# EAGLE design irsm-v1 (EAGLE 7.6.0)
CNAME: IRS sensor (RFM69HW); CREVISION: 1; DESIGNER: Dariusz Mazur
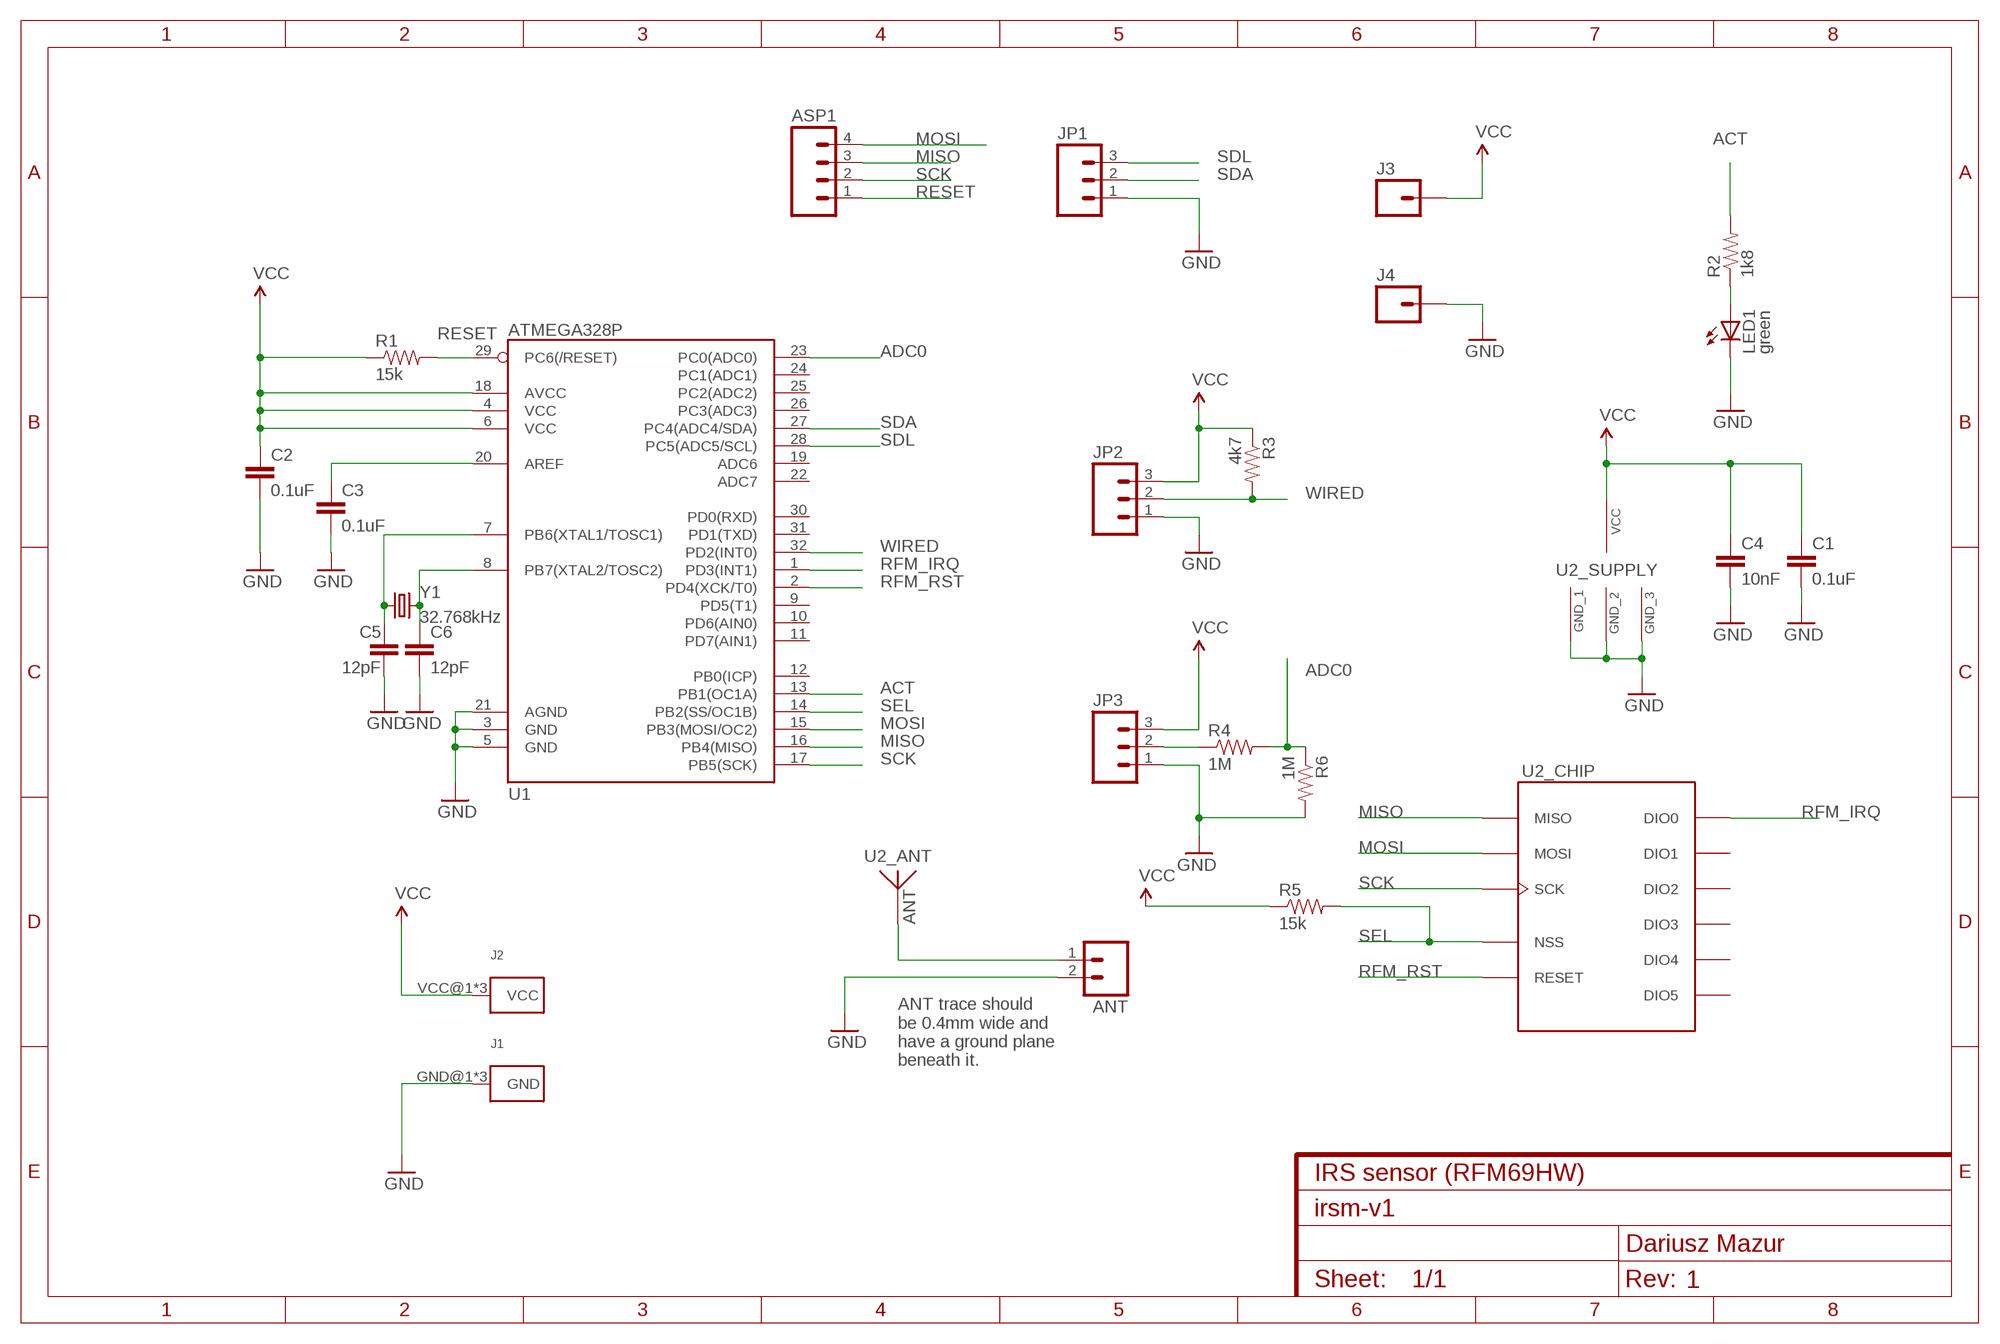
[diagram p0: schematic, sheet 1]

## Parts
ANT  M02PTH3  [1X02_LONGPADS]
ASP1  M04PTH  [1X04]
C1  0.1uF  0.1UF-25V(+80/-20%)(0603)  [0603-CAP]
C2  0.1uF  0.1UF-25V(+80/-20%)(0603)  [0603-CAP]
C3  0.1uF  0.1UF-25V(+80/-20%)(0603)  [0603-CAP]
C4  10nF  CAP0603-CAP  [0603-CAP]
C5  12pF  12PF-50V-5%(0603)  [0603-CAP]
C6  12pF  12PF-50V-5%(0603)  [0603-CAP]
J1  KEYSTONE-629  [KEYSTONE_AA_AAA_BATTERY_TERMINAL-629]
J2  KEYSTONE-637  [KEYSTONE_AA_AAA_BATTERY_TERMINAL-637]
J3  M01PTH  [1X01]
J4  M01PTH  [1X01]
JP1  M03PTH  [1X03]
JP2  M03PTH  [1X03]
JP3  M03PTH  [1X03]
LED1  green  LED0603  [LED-0603]
R1  15k  RESISTOR0603-RES  [0603-RES]
R2  1k8  RESISTOR0603-RES  [0603-RES]
R3  4k7  RESISTOR0603-RES  [0603-RES]
R4  1M  RESISTOR0603-RES  [0603-RES]
R5  15k  RESISTOR0603-RES  [0603-RES]
R6  1M  RESISTOR0603-RES  [0603-RES]
U1  ATMEGA328P  ATMEGA328_SMT  [TQFP32-08]
U2  RFM69HCW-S2  [HOPE-RF-16]
Y1  32.768kHz  CRYSTAL3.2X1.5MM  [CRYSTAL-SMD-3.2X1.5MM]

## Nets
ACT: R2.2 U1.13(PB1(OC1A))
ADC0: R4.2 R6.1 U1.23(PC0(ADC0))
GND: ANT.2 C1.2 C2.2 C3.2 C4.2 C5.2 C6.2 J1.GND@1(GND) J1.GND@2(GND) J1.GND@3(GND) J4.1 JP1.1 JP2.1 JP3.1 LED1.C R6.2 U1.3(GND) U1.5(GND) U1.21(AGND) U2.GND1(_SUPPLY:GND_1) U2.GND2(_SUPPLY:GND_2) U2.GND3(_SUPPLY:GND_3)
MISO: ASP1.3 U1.16(PB4(MISO)) U2.MISO(_CHIP:MISO)
MOSI: ASP1.4 U1.15(PB3(MOSI/OC2)) U2.MOSI(_CHIP:MOSI)
N$1: LED1.A R2.1
N$2: JP3.2 R4.1
N$3: ANT.1 U2.ANT(_ANT:ANT)
N$4: C3.1 U1.20(AREF)
N$5: C5.1 U1.7(PB6(XTAL1/TOSC1)) Y1.P$1
N$6: C6.1 U1.8(PB7(XTAL2/TOSC2)) Y1.P$2
RESET: ASP1.1 R1.2 U1.29(PC6(/RESET))
RFM_IRQ: U1.1(PD3(INT1)) U2.DIO0(_CHIP:DIO0)
RFM_RST: U1.2(PD4(XCK/T0)) U2.RESET(_CHIP:RESET)
SCK: ASP1.2 U1.17(PB5(SCK)) U2.SCK(_CHIP:SCK)
SDA: JP1.2 U1.27(PC4(ADC4/SDA))
SDL: JP1.3 U1.28(PC5(ADC5/SCL))
SEL: R5.2 U1.14(PB2(SS/OC1B)) U2.NSS(_CHIP:NSS)
VCC: C1.1 C2.1 C4.1 J2.VCC@1(VCC) J2.VCC@2(VCC) J2.VCC@3(VCC) J3.1 JP2.3 JP3.3 R1.1 R3.1 R5.1 U1.4(VCC) U1.6(VCC) U1.18(AVCC) U2.3.3V(_SUPPLY:VCC)
WIRED: JP2.2 R3.2 U1.32(PD2(INT0))
Unconnected: U1.9(PD5(T1)) U1.10(PD6(AIN0)) U1.11(PD7(AIN1)) U1.12(PB0(ICP)) U1.19(ADC6) U1.22(ADC7) U1.24(PC1(ADC1)) U1.25(PC2(ADC2)) U1.26(PC3(ADC3)) U1.30(PD0(RXD)) U1.31(PD1(TXD)) U2.DIO1(_CHIP:DIO1) U2.DIO2(_CHIP:DIO2) U2.DIO3(_CHIP:DIO3) U2.DIO4(_CHIP:DIO4) U2.DIO5(_CHIP:DIO5)

## Notes on the sheet
- ANT trace should
  be 0.4mm wide and
  have a ground plane
  beneath it.

## Library data of the parts
ANT = SparkFun-Connectors:M02: Standard 2-pin 0.1" header. Use with - straight break away headers ( PRT-00116) - right angle break away headers (PRT-00553) - swiss pins (PRT-00743) - machine pins (PRT-00117) - female headers (PRT-00115) Molex polarized connector foot print use with: PRT-08233 with associated crimp pins and housings. 2.54_SCREWTERM for use with PRT-10571. 3.5mm Screw Terminal footprints for PRT-08084 5mm Screw Terminal footprints for use with PRT-08432
ASP1 = SparkFun-Connectors:M04: Header 4 Standard 4-pin 0.1" header. Use with straight break away headers (SKU : PRT-00116), right angle break away headers (PRT-00553), swiss pins (PRT-00743), machine pins (PRT-00117), and female headers (PRT-00115). Molex polarized connector foot print use with SKU : PRT-08231 with associated crimp pins and housings. 1MM SMD Version SKU: PRT-10208; PROD_ID: CONN-09696
C1-C3 = SparkFun-Capacitors:0.1UF-25V(+80/-20%)(0603): CAP-00810 Ceramic Standard decoupling cap; PROD_ID: CAP-00810
C4 = SparkFun-Capacitors:CAP: Capacitor Standard 0603 ceramic capacitor, and 0.1" leaded capacitor.
C5 C6 = SparkFun-Capacitors:12PF-50V-5%(0603): CAP-09137; PROD_ID: CAP-09137
J1 = kanflo:KEYSTONE-629: Keystone 629 PCB Mount Battery Contact for 1 (AA), 1 (AAA), 1 (N), Coil Spring Contact Links Data sheet <http://docs-europe.electrocomponents.com/webdocs/002e/0900766b8002ef6f.pdf> RS Online <http://se.rs-online.com/web/p/battery-holders-mounts/2050057/>
J2 = kanflo:KEYSTONE-637: Keystone 637 PCB Mount Battery Contact for 1 (AA), 1 (AAA), 1 (N), Button Contact Links Data sheet <http://docs-europe.electrocomponents.com/webdocs/13ee/0900766b813ee63e.pdf> RS Online <http://se.rs-online.com/web/p/battery-holders-mounts/3670602/>
J3 J4 = SparkFun-Connectors:M01: Header 1 Standard 1-pin 0.1" header. Use with straight break away headers (SKU : PRT-00116), right angle break away headers (PRT-00553), swiss pins (PRT-00743), machine pins (PRT-00117), and female headers (PRT-00115). SMTSO-256-ET is a "flush mount" nut for a 4-40 screw. The older package used to be too tight, and did not allow it to sit properly thru the drill hit. The latest (0.165DIA) fits nice and snug.
JP1-JP3 = SparkFun-Connectors:M03: Header 3 Standard 3-pin 0.1" header. Use with straight break away headers (SKU : PRT-00116), right angle break away headers (PRT-00553), swiss pins (PRT-00743), machine pins (PRT-00117), and female headers (PRT-00115). Molex polarized connector foot print use with SKU : PRT-08232 with associated crimp pins and housings.
LED1 = SparkFun-LED:LED: LEDs Standard schematic elements and footprints for 5mm, 3mm, 1206, and 0603 sized LEDs. 5mm - Spark Fun Electronics SKU : COM-00529 (and others)
R1-R6 = SparkFun-Passives:RESISTOR: Resistor Basic schematic elements and footprints for 0603, 1206, and PTH resistors.
U1 = SparkFun-DigitalIC:ATMEGA328_SMT: 32-Pin Atmega328 part Commonly used on Arduino compatible boards Available in QFP and QFN packages TQFP is IC-09069 QFN is non-stock; PROD_ID: IC-09069
U2 = icmi-custom-parts:RFM69HCW: HopeRF RFM69HCW ISM Transceiver Module The RFM69HCW <http://www.hoperf.com/rf/fsk_module/RFM69HCW.htm> is a transceiver module capable of operation over a wide frequency range, including the 315,433,868 and 915MHz license-free ISM (Industry Scientific and Medical) frequency bands. All major RF communication parameters are programmable and most of them can be dynamically set. The RFM69HCW offers the unique advantage of programmable narrow-band and wide- band communication modes. The RFM69HCW is optimized for low power consumption while offering high RF output power and channelized operation. Compliance ETSI and FCC regulations. In order to better use RFM69HCW modules, this specification also involves a large number of the parameters and functions of its core chip RF69H's,including those IC pins which are not leaded out. All of these can help customers gain a better understanding of the performance of RFM69HCW modules, and enhance the application skills.
Y1 = SparkFun-FreqCtrl:CRYSTAL: Various standard crystals. Proven footprints.; PROD_ID: XTAL-13062

## Board
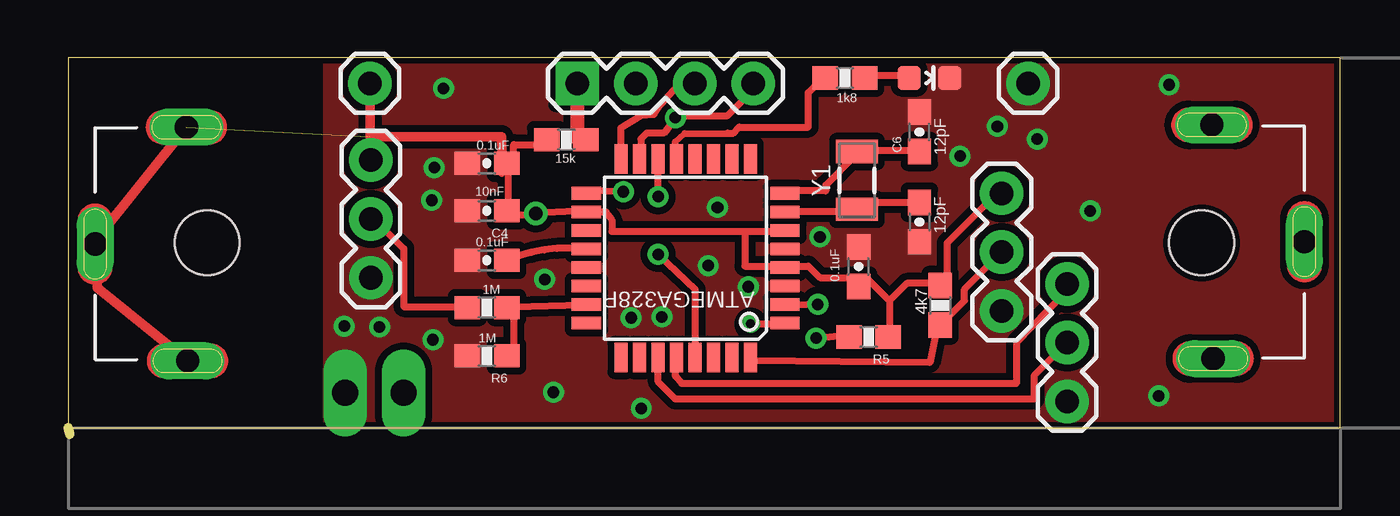
[diagram p1: board, top side]
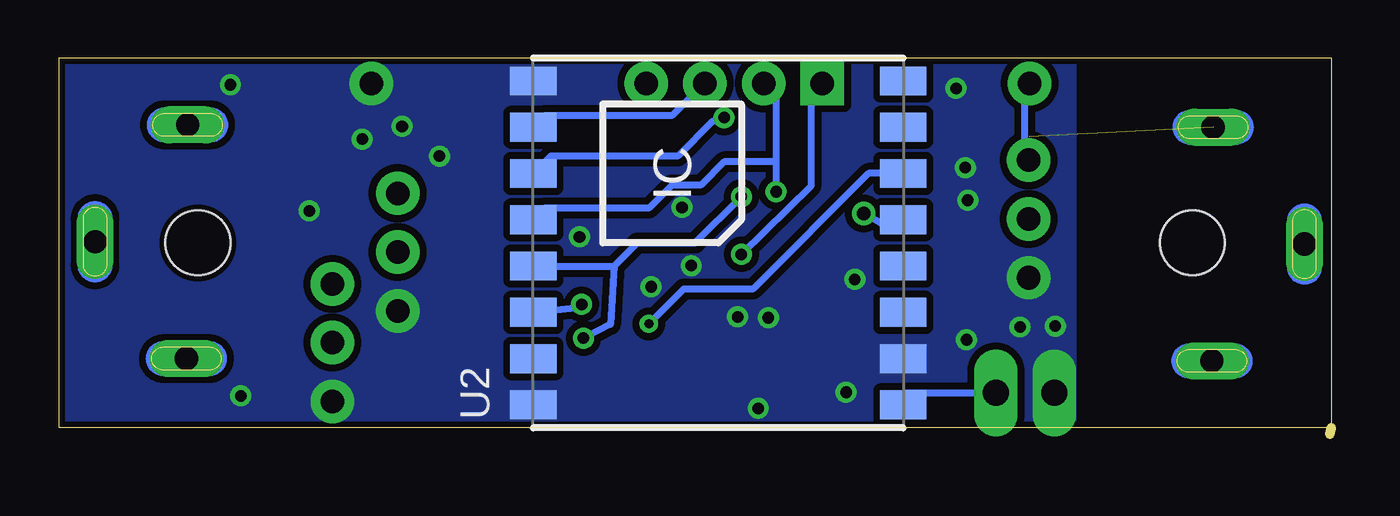
[diagram p2: board, bottom side, seen from below]

Size 55 x 16.26 mm. Coordinates in mm from the lower left corner, seen from the top.
Outline: 0,0.26 55,0.26 55,16.26 0,16.26 0,0.26
Outline: 0,0.26 0.05,0
Copper layers (1*16): Top 0.035mm / dielectric 1.5mm / Bottom 0.035mm
Design rules "dirt_cheap_dirty_boards.v1 *": minimum track width 12mil, minimum drill 15mil, track to track 12mil, track to pad 12mil, pad to pad 12mil, via to via 12mil, smd to smd 0mil, copper to edge 10mil, drill to drill 12mil, minimum pad ring 12mil, minimum via ring 8mil, stop-mask expansion 2mil, vias tented up to drill 25mil, thermal gap 10mil
Holes 2.8 mm at 49,8.26 6,8.26
tRestrict: area 0,0.3 to 11,16.3
bRestrict: area 0,0.3 to 11,16.3

### Footprints (pad centres in the part's own frame; a part is rotated, then mirrored left to right if it is on the bottom)
1X02_LONGPADS = drill 1.118 pad 1.88 long: 1 0,0; 2 2.54,0
1X04 = drill 1.016 pad 1.88 square: 1 0,0 | drill 1.016 pad 1.88: 2 2.54,0; 3 5.08,0; 4 7.62,0
0603-CAP = smd 1.1 x 1: 1 -0.85,0; 2 0.85,0
KEYSTONE_AA_AAA_BATTERY_TERMINAL-629 = drill 1 pad 1.5 long: GND@1 5,-0.5; GND@2 -0.05,3.45; GND@3 -5.1,-0.55
KEYSTONE_AA_AAA_BATTERY_TERMINAL-637 = drill 1 pad 1.5 long: VCC@1 5,-1.1; VCC@2 -0.05,2.85; VCC@3 -5.1,-1.15
1X01 = drill 1.016 pad 1.88: 1 0,0
1X03 = drill 1.016 pad 1.88: 1 0,0; 2 2.54,0; 3 5.08,0
LED-0603 = smd 1 x 1: A 0,-0.877; C 0,0.877
0603-RES = smd 1.1 x 1: 1 -0.85,0; 2 0.85,0
TQFP32-08 = smd 1.27 x 0.559: 1 -4.293,2.8; 2 -4.293,2; 3 -4.293,1.2; 4 -4.293,0.4; 5 -4.293,-0.4; 6 -4.293,-1.2; 7 -4.293,-2; 8 -4.293,-2.8; 17 4.293,-2.8; 18 4.293,-2; 19 4.293,-1.2; 20 4.293,-0.4; 21 4.293,0.4; 22 4.293,1.2; 23 4.293,2; 24 4.293,2.8 | smd 0.559 x 1.27: 9 -2.8,-4.293; 10 -2,-4.293; 11 -1.2,-4.293; 12 -0.4,-4.293; 13 0.4,-4.293; 14 1.2,-4.293; 15 2,-4.293; 16 2.8,-4.293; 25 2.8,4.293; 26 2,4.293; 27 1.2,4.293; 28 0.4,4.293; 29 -0.4,4.293; 30 -1.2,4.293; 31 -2,4.293; 32 -2.8,4.293
HOPE-RF-16 = smd 1.25 x 2: 3.3V 1,-8; ANT -7,-8; DIO0 3,-8; DIO1 5,-8; DIO2 7,-8; DIO3 -3,-8; DIO4 -1,-8; DIO5 -5,8; GND1 7,8; GND2 -7,8; GND3 -5,-8; MISO 5,8; MOSI 3,8; NSS -1,8; RESET -3,8; SCK 1,8
CRYSTAL-SMD-3.2X1.5MM = smd 1 x 1.8: P$1 -1.25,0; P$2 1.25,0

### Placement (x,y rotation side)
ANT  14.5,1.78 0 bottom
ASP1  22,15.16 0 top
C1  18.1,11.71 180 top
C2  34.17,7.23 90 top
C3  18.1,7.51 180 top
C4  18.1,9.65 180 top
C5  36.8,9.16 270 top
C6  36.8,13.06 90 top
J1  50,8.26 270 top
J2  4,8.26 90 top
J3  13.04,15.16 0 top
J4  41.5,15.16 90 top
JP1  43.19,1.41 90 top
JP2  40.36,5.33 90 top
JP3  13.07,6.76 90 top
LED1  37.23,15.39 270 top
R1  21.53,12.72 0 top
R2  33.58,15.39 180 top
R3  37.7,5.56 270 top
R4  18.1,5.46 0 top
R5  34.61,4.2 180 top
R6  18.1,3.38 180 top
U1  26.69,7.6 180 top
U2  26.5,8.26 90 bottom
Y1  34.1,10.96 90 top

### Tracks (layer width: path | path; a pad name or v marks a point on that pad's centre or on a via)
ACT
  Top 0.254: 26.24,12.62 26.65,12.99
  Top 0.305: 26.65,12.99 28.5,13.01 28.75,13.01 29,13.26 32,13.26 32,14.76 32.5,15.26 R2.2 | 26.24,12.62 26.25,12.01 U1.13
ADC0
  Top 0.305: R6.1 19.25,3.51 19.25,5.26 R4.2 19.25,5.51 22.25,5.59 U1.23
GND  (via drill 0.5 pad 0.25)
  Top 0.305: 22.5,7.26 U1.21
  other vias: 15.82,11.52 25.66,5.06 13.45,4.63 11.93,4.67 15.77,4.08 20.97,1.81 44.19,9.65 15.71,10.11 47.15,1.65 41.9,12.75 40.17,13.3 47.6,15.1 27.67,7.28 38.56,12.02 24.77,1.11 29.4,6.37 16.22,14.94 24.34,5.03 20.6,6.68 28.07,9.8 32.5,8.52
  pour Bottom (rank 6, no thermals): 0,16.26 55,16.26 55,0.26 0,0.26
  pour Top (rank 6, no thermals): 0,16.26 55,16.26 55,0.26 0,0.26
MISO
  Top 0.305: U1.16 23.88,12.22 23.88,13.22 24.75,13.76 25.31,13.81 25.45,14.06 26.31,15.02 27,15.01 ASP1.3
  Bottom 0.305: U2.MISO 34,13.76 28.5,13.76 27.25,15.01 ASP1.3
MOSI  (via drill 0.5)
  Top 0.254: v26.25,13.68 26.5,13.76
  Top 0.305: v26.25,13.68 25.75,13.01 25,13.01 24.75,12.76 24.75,12.01 U1.15 | 26.5,13.76 28.5,13.76 29.5,14.76 ASP1.4
  Bottom 0.305: U2.MOSI 33.75,12.01 28.25,12.01 26.75,13.51 v26.25,13.68
N$1
  Top 0.305: LED1.A 36.25,15.51 34.5,15.51 R2.1
N$2
  Top 0.305: R4.1 17.25,5.51 14.5,5.51 14.5,8.01 13.25,9.26 JP3.2
N$3
  Bottom 0.305: U2.ANT 18.5,1.78 ANT.1
N$4
  Top 0.305: U1.20 22.25,8.01 arc27 C3.1
N$5
  Top 0.254: 31,9.64 U1.7
  Top 0.305: C5.1 34.25,10.01 34.25,9.76 Y1.P$1 33.99,9.61 31.05,9.6 U1.7
N$6
  Top 0.305: C6.1 36.75,12.26 34.25,12.26 Y1.P$2 34,12.01 32.75,10.76 32.75,10.51 31,10.51 U1.8
RESET  (via drill 0.5)
  Top 0.305: 22,12.76 R1.2 | v25.5,7.76 27.1,6.26 27.1,3.8 U1.29
  Top 0.61: ASP1.1 22,12.76
  Bottom 0.305: v25.5,7.76 22.5,10.7 22.5,14.76 22,14.76 ASP1.1
RFM_IRQ  (via drill 0.38)
  Top 0.305: v29.5,4.76 30.5,4.76 U1.1
  Bottom 0.305: v29.5,4.76 28,6.26 25,6.26 20,11.26 U2.DIO0
RFM_RST  (via drill 0.5)
  Top 0.305: v32.4,5.6 30.97,5.54 U1.2
  Bottom 0.305: v32.4,5.6 32.69,5.46 U2.RESET
SCK  (via drill 0.5)
  Top 0.305: v24,10.47 22.5,10.51 U1.17
  Bottom 0.305: 24,11.76 24,15.01 24.5,15.01 ASP1.2 | 24,11.76 v24,10.47 | U2.SCK 34,9.76 29.5,9.76 28.5,10.76 27.25,10.76 26.25,11.76 24,11.76
SDA
  Top 0.305: U1.27 25.5,3.26 25.5,2.26 26.25,1.51 41.75,1.51 41.75,2.51 43,3.76 JP1.2
SDL
  Top 0.305: U1.28 26.25,3.26 26.25,2.51 26.53,2.18 40.99,2.18 41,3.94 43,6.01 43,6.26 JP1.3
SEL  (via drill 0.5)
  Top 0.305: v32.34,4.15 33.5,4.26 R5.2 | v25.5,10.26 25.5,11.76 U1.14
  Bottom 0.305: v32.34,4.15 31.16,4.75 31,7.26 | U2.NSS 31,7.26 | v25.5,10.26 27.5,8.26 30,8.26 31,7.26
VCC  (via drill 0.6)  (1 unrouted)
  Top 0.305: 29.25,8.76 23.5,8.76 23.5,9.26 23.25,9.59 22.52,9.59 U1.18 22.37,9.66 v20.21,9.53 19.95,9.47 19,9.47 C4.1 | 29.25,8.76 30.75,8.76 U1.6 31,8.76 | 18.75,11.26 C1.1 | JP2.3 40,10.26 38,8.26 38,6.76 R3.1 37.5,6.51 36.25,6.51 35.5,5.76 | 29.25,8.76 29.25,7.26 30.75,7.26 U1.4 31,7.26 32,7.26 32.5,6.76 34,6.76 C2.1 | 34,6.51 C2.1 | 35.5,5.76 35.5,4.26 R5.1 | 35.5,5.76 34.5,6.76 C2.1 | 19.25,11.51 C1.1 | R1.1 20.5,12.51 19.25,12.51 19.25,11.76 C1.1 | C4.1 19,9.79 19,11.69 C1.1 | 19.07,9.66 C4.1 | 18.75,12.01 18.75,11.76 C1.1
  Top 0.406: J2.VCC@1 1.23,8.47 J2.VCC@2 1.23,6.32 J2.VCC@3 | 18.75,12.01 18.73,12.86 13.04,12.86 J3.1
  Bottom 0.305: 19.32,9.15 U2.3.3V | v20.21,9.53 19.32,9.03 U2.3.3V | 18.37,9.47 U2.3.3V | J3.1 13.25,15.01 13.25,12.01 JP3.3
WIRED
  Top 0.305: U1.32 29.5,3.18 37.24,3.09 37.5,4.26 R3.2 37.75,4.76 38.75,5.76 38.75,6.26 40.25,7.76 JP2.2

### Text on the board
Document: RESET | VCC | SCK | MISO | MOSI | GND | AC0 | PD2 | AC5 | AC4 | ANT